# Altium schematic sheet CAN 3V3.SchDoc
size A
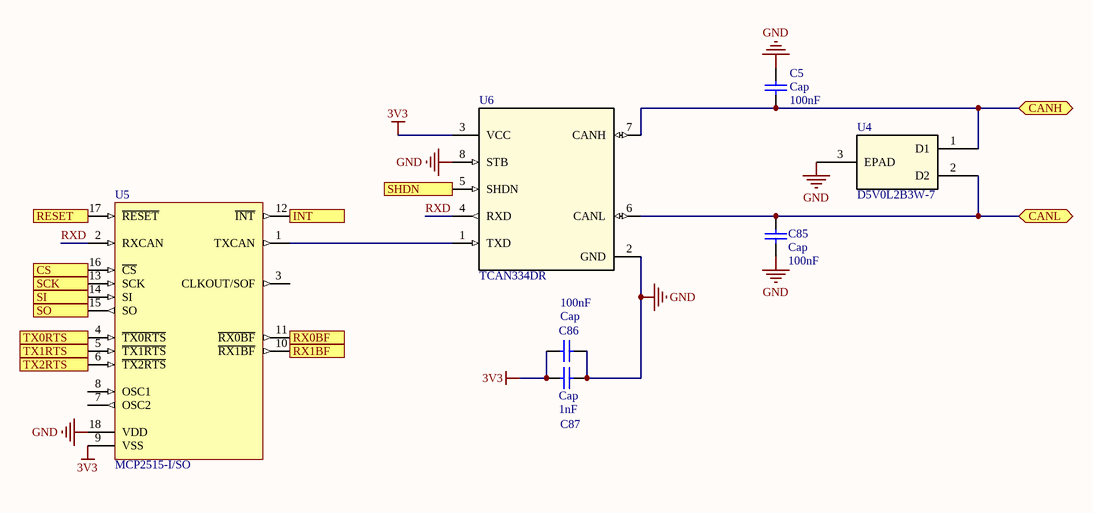
[diagram p0: CAN 3V3.SchDoc]

## Parts
C5  Cap  value 100nF  [1608[0603]]
C85  Cap  value 100nF  [1608[0603]]
C86  Cap  value 100nF  [1608[0603]]
C87  Cap  value 1nF  [1608[0603]]
U4  D5V0L2B3W-7  [SOT-323_DIO]
U5  MCP2515-I/SO  [SOIC-SO18_L]
U6  TCAN334DR  [D0008A_N]

## Ports
CANH (bidir), CANL (bidir), CS (in), INT (out), RESET (in), RX0BF (out), RX1BF (out), SCK (in), SHDN (in), SI (in), SO (out), TX0RTS (in), TX1RTS (in), TX2RTS (in)

## Nets
3V3: C86.1 C87.2 U5.9(VSS) U6.3(VCC)
GND: C5.1 C85.1 C86.2 C87.1 U4.3(EPAD) U5.18(VDD) U6.2(GND) U6.8(STB)
CANH: C5.2 U4.1(D1) U6.7(CANH) ; port CANH
CANL: C85.2 U4.2(D2) U6.6(CANL) ; port CANL
CS: U5.16(~{CS}) ; port CS
INT: U5.12(~{INT}) ; port INT
RESET: U5.17(~{RESET}) ; port RESET
RX0BF: U5.11(~{RX0BF}) ; port RX0BF
RX1BF: U5.10(~{RX1BF}) ; port RX1BF
RXD: U5.2(RXCAN) U6.4(RXD)
SCK: U5.13(SCK) ; port SCK
SHDN: U6.5(SHDN) ; port SHDN
SI: U5.14(SI) ; port SI
SO: U5.15(SO) ; port SO
TX0RTS: U5.4(~{TX0RTS}) ; port TX0RTS
TX1RTS: U5.5(~{TX1RTS}) ; port TX1RTS
TX2RTS: U5.6(~{TX2RTS}) ; port TX2RTS
NetU5_1: U5.1(TXCAN) U6.1(TXD)

Not connected (* = marked no-connect by the designer): U5 3(CLKOUT/SOF) 7(OSC2) 8(OSC1)

## Library data of the parts
C5 C85-C87 = Cap: Capacitor; Published: 8-Jun-2000; LatestRevisionDate: 17-Jul-2002; LatestRevisionNote: Re-released for DXP Platform.; PackageReference: RAD-0.3; Publisher: Altium Limited; PackageDescription: Radial Cap, Thru-Hole; 2 Leads; 0.3 in Pin Spacing
U4 = D5V0L2B3W-7: No Description Available; Vendor: Diodes Inc; Built_By: EMA_UL_Team; SourceLibrary: DIODESINC_2_2015-08-18; Manufacturer_Part_Number: D5V0L2B3W-7; Copyright: Copyright (C) 2018 Accelerated Designs. All rights reserved; RefDes: RefDes; Type: DEV
U5 = CMP-0186-00133-2: Stand-Alone CAN Controller With SPI Interface, 18-Pin SOIC, Industrial Temperature; ComponentLink2Description: Datasheet; RevisionNote: URLs added. DatasheetVersion updated.; PackageVersion: revBB, Aug-2009; ComponentLink1URL: http://www.microchip.com/; PackageReference: SOIC-SO18; PackageDescription: 18-Lead Plastic Small Outline (SO) - Wide 7.50mm Body [SOIC]; DatasheetVersion: revF, Oct-2010; ComponentLink2URL: http://ww1.microchip.com/downloads/en/DeviceDoc/21801f.pdf; ComponentLink3URL: http://www.microchip.com/stellent/groups/techpub_sg/documents/packagingspec/en012702.pdf; Code_JEDEC: MS-013; ComponentLink3Description: Package Specification; ComponentLink1Description: Manufacturer URL
U6 = TCAN334DR: No Description Available; Manufacturer: Texas Instruments; PartNumber: TCAN334DR; RefDes: RefDes; Type: DEV; Value: Value; Copyright: Copyright (C) 2018 Accelerated Designs. All rights reserved